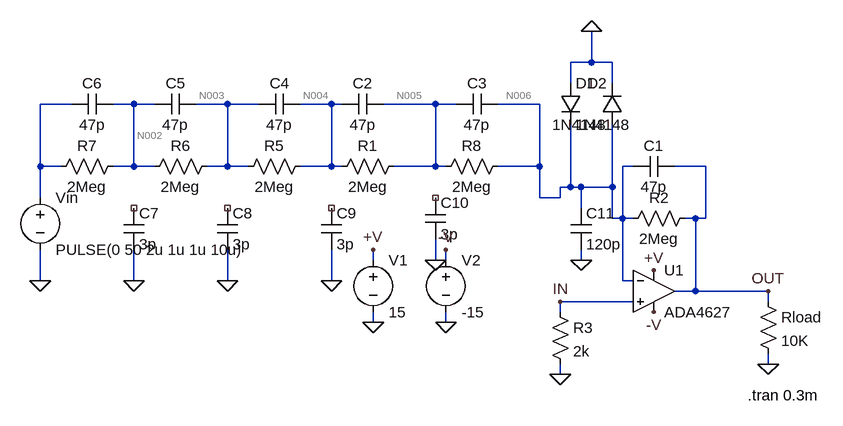
[diagram p0: schematic del5.asc]
* del5.asc
V1 +V 0 15
Vin N001 0 PULSE(0 50 2u 1u 1u 10u)
R2 OUT N006 2Meg
V2 -V 0 -15
Rload OUT 0 10K
* U1: ADA4627 (symbol ADA4627 not available, pins judged from their places): In+=IN In-=N006 V+=+V V-=-V OUT=OUT
R3 IN 0 2k
C1 OUT N006 47p
R1 N005 N004 2Meg
R5 N004 N003 2Meg
R6 N003 N002 2Meg
R7 N002 N001 2Meg
R8 N006 N005 2Meg
C2 N005 N004 47p
C3 N006 N005 47p
C4 N004 N003 47p
C5 N003 N002 47p
C6 N002 N001 47p
C7 NC_01 0 3p
C8 NC_02 0 3p
C9 NC_03 0 3p
C10 NC_04 0 3p
D1 0 N006 1N4148
D2 N006 0 1N4148
C11 N006 0 120p
.model D D
.lib standard.dio
.tran 0.3m
.backanno
.end

* Results of the author's LTspice run, read from the files saved beside the schematic
* Operating Point, zero values left out:
*   V(+v) = 15 V
*   V(out) = -446.8 µV
*   V(n006) = -292.3 µV
*   V(-v) = -15 V
*   V(in) = 30.05 nV
*   V(n005) = -233.8 µV
*   V(n004) = -175.4 µV
*   V(n003) = -116.9 µV
*   V(n002) = -58.46 µV
*   I(D1) = 16.31 pA
*   I(D2) = -16.2 pA
*   I(R2) = -77.26 pA
*   I(Rload) = -44.68 nA
*   I(R3) = 15.02 pA
*   I(R1) = -29.23 pA
*   I(R5) = -29.23 pA
*   I(R6) = -29.23 pA
*   I(R7) = -29.23 pA
*   I(R8) = -29.23 pA
*   I(V1) = -6.899 mA
*   I(Vin) = -29.23 pA
*   I(V2) = 6.899 mA
*   Ix(u1:1) = -15.02 pA
*   Ix(u1:2) = -15.52 pA
*   Ix(u1:99) = 6.899 mA
*   Ix(u1:50) = -6.899 mA
*   Ix(u1:30) = 44.76 nA
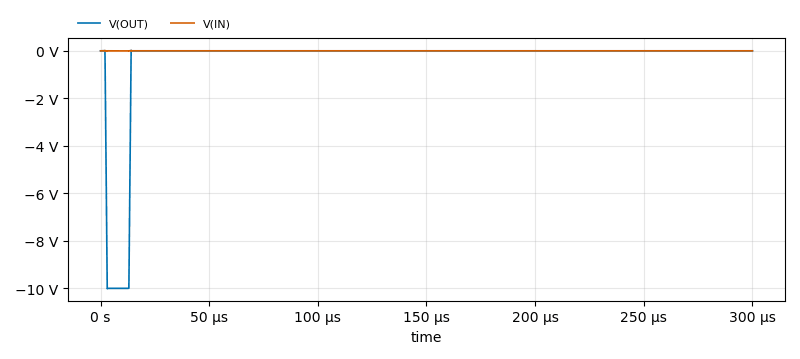
[diagram p1: Transient Analysis of del5.asc, plotted from the saved traces]
* Transient Analysis, 1 run:
*   V(OUT): min -10.02 V, max 18.89 mV, average -367.1 mV, rms 1.886 V, last -435.8 µV
*   V(IN): min -14.41 mV, max 14.39 mV, average 48.46 nV, rms 389.1 µV, last 30.05 nV